# Altium schematic sheet radio.SchDoc
size A4
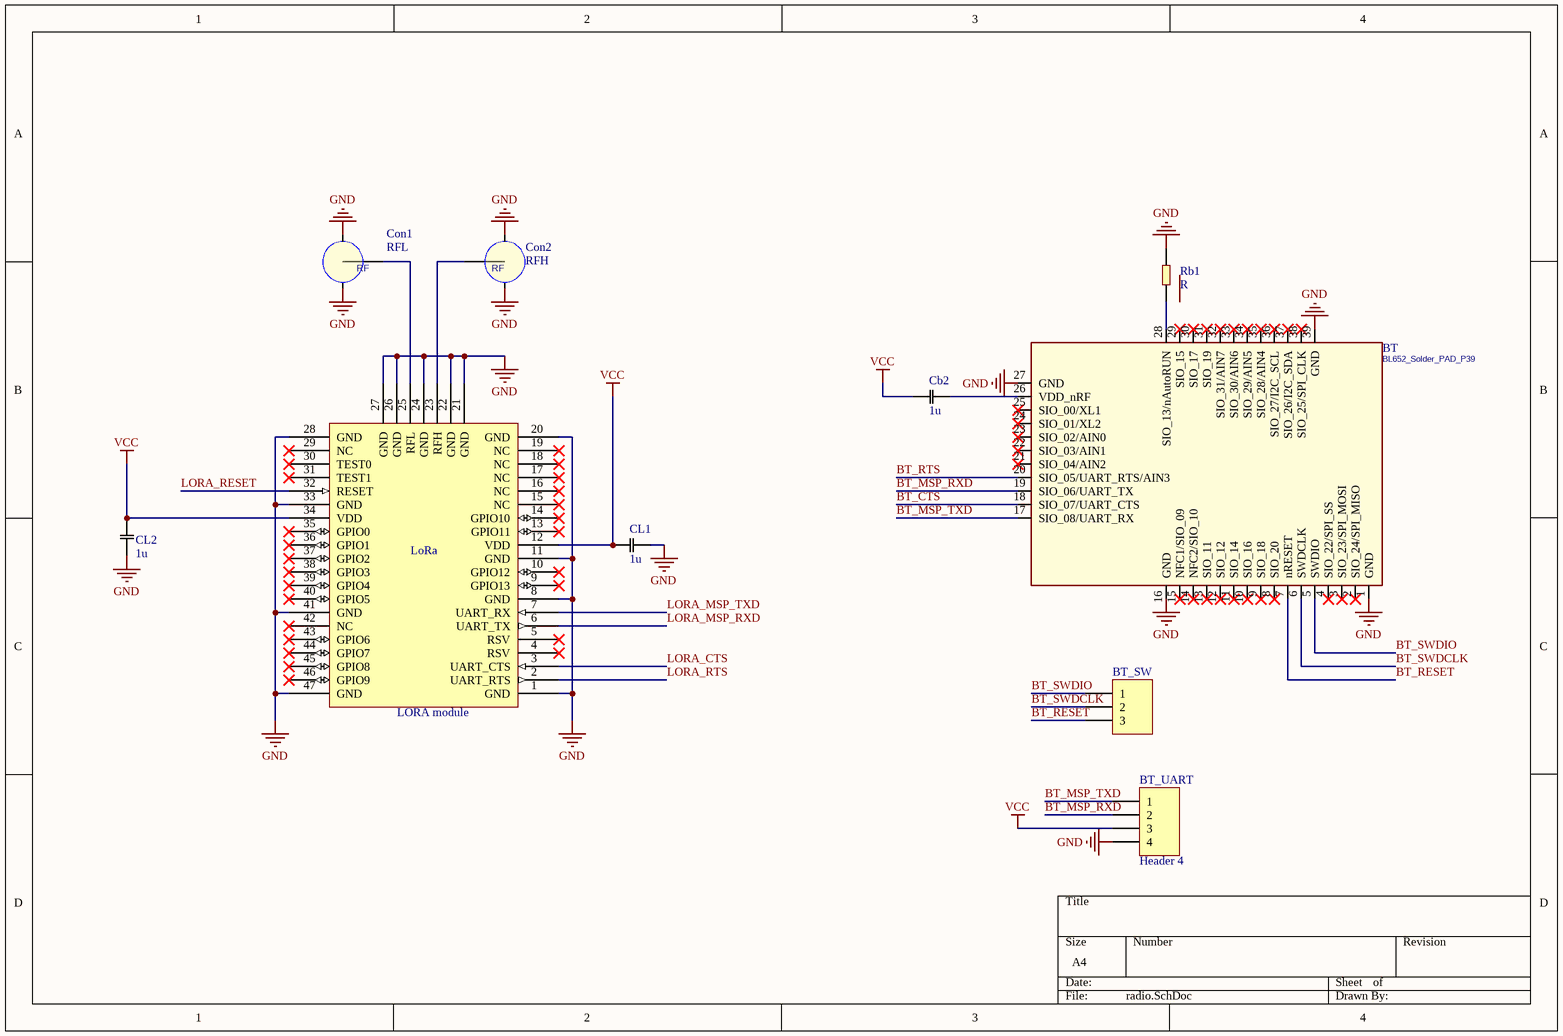
[diagram p0: radio.SchDoc]

## Parts
BT  BL652_Solder_PAD_P39  [XCVR_BL652-SA-01]
BT_SW  (no value)  [HDR1X3]
BT_UART  Header 4  [HDR1X4]
Cb2  1u  [603]
CL1  1u  [603]
CL2  1u  [603]
Con1  RFL  [IPEX]
Con2  RFH  [IPEX]
LoRa  LORA module  [RN2483]
Rb1  R  [603]

## Nets
GND: BT.1(GND) BT.16(GND) BT.27(GND) BT.39(GND) BT_UART.4 CL1.2 CL2.1 Con1.2 Con1.3 Con2.2 Con2.3 LoRa.1(GND) LoRa.8(GND) LoRa.11(GND) LoRa.20(GND) LoRa.21(GND) LoRa.22(GND) LoRa.24(GND) LoRa.26(GND) LoRa.27(GND) LoRa.28(GND) LoRa.33(GND) LoRa.41(GND) LoRa.47(GND) Rb1.1
VCC: BT_UART.3 Cb2.1 CL1.1 CL2.2 LoRa.12(VDD) LoRa.34(VDD)
BT_CTS: BT.18(SIO_07/UART_CTS)
BT_MSP_RXD: BT.19(SIO_06/UART_TX) BT_UART.2
BT_MSP_TXD: BT.17(SIO_08/UART_RX) BT_UART.1
BT_RESET: BT.7(nRESET) BT_SW.3
BT_RTS: BT.20(SIO_05/UART_RTS/AIN3)
BT_SWDCLK: BT.6(SWDCLK) BT_SW.2
BT_SWDIO: BT.5(SWDIO) BT_SW.1
LORA_CTS: LoRa.3(UART_CTS)
LORA_MSP_RXD: LoRa.6(UART_TX)
LORA_MSP_TXD: LoRa.7(UART_RX)
LORA_RESET: LoRa.32(RESET)
LORA_RTS: LoRa.2(UART_RTS)
NetBT_26: BT.26(VDD_nRF) Cb2.2
NetBT_28: BT.28(SIO_13/nAutoRUN) Rb1.2
NetCon1_1: Con1.1(RF) LoRa.25(RFL)
NetCon2_1: Con2.1(RF) LoRa.23(RFH)

Not connected (* = marked no-connect by the designer): BT 2(SIO_24/SPI_MISO)* 3(SIO_23/SPI_MOSI)* 4(SIO_22/SPI_SS)* 8(SIO_20)* 9(SIO_18)* 10(SIO_16)* 11(SIO_14)* 12(SIO_12)* 13(SIO_11)* 14(NFC2/SIO_10)* 15(NFC1/SIO_09)* 21(SIO_04/AIN2)* 22(SIO_03/AIN1)* 23(SIO_02/AIN0)* 24(SIO_01/XL2)* 25(SIO_00/XL1)* 29(SIO_15)* 30(SIO_17)* 31(SIO_19)* 32(SIO_31/AIN7)* 33(SIO_30/AIN6)* 34(SIO_29/AIN5)* 35(SIO_28/AIN4)* 36(SIO_27/I2C_SCL)* 37(SIO_26/I2C_SDA)* 38(SIO_25/SPI_CLK)*; LoRa 4(RSV)* 5(RSV)* 9(GPIO13)* 10(GPIO12)* 13(GPIO11)* 14(GPIO10)* 15(NC)* 16(NC)* 17(NC)* 18(NC)* 19(NC)* 29(NC)* 30(TEST0)* 31(TEST1)* 35(GPIO0)* 36(GPIO1)* 37(GPIO2)* 38(GPIO3)* 39(GPIO4)* 40(GPIO5)* 42(NC)* 43(GPIO6)* 44(GPIO7)* 45(GPIO8)* 46(GPIO9)*

## Library data of the parts
BT = BL652_Solder_PAD_P39: BL652 Solder PAD; E Number: ?
BT_SW = Header 3: Header, 3-Pin; LatestRevisionDate: 17-Jul-2002; LatestRevisionNote: Re-released for DXP Platform.; Publisher: Altium Limited
BT_UART = Header 4: Header, 4-Pin; LatestRevisionDate: 17-Jul-2002; LatestRevisionNote: Re-released for DXP Platform.; Publisher: Altium Limited
Cb2 CL1 CL2 = C: Capacitor
Con1 Con2 = IPEX/U.FL: SMA PCB Edge Receptacle
LoRa = Lora
Rb1 = R: Resistor